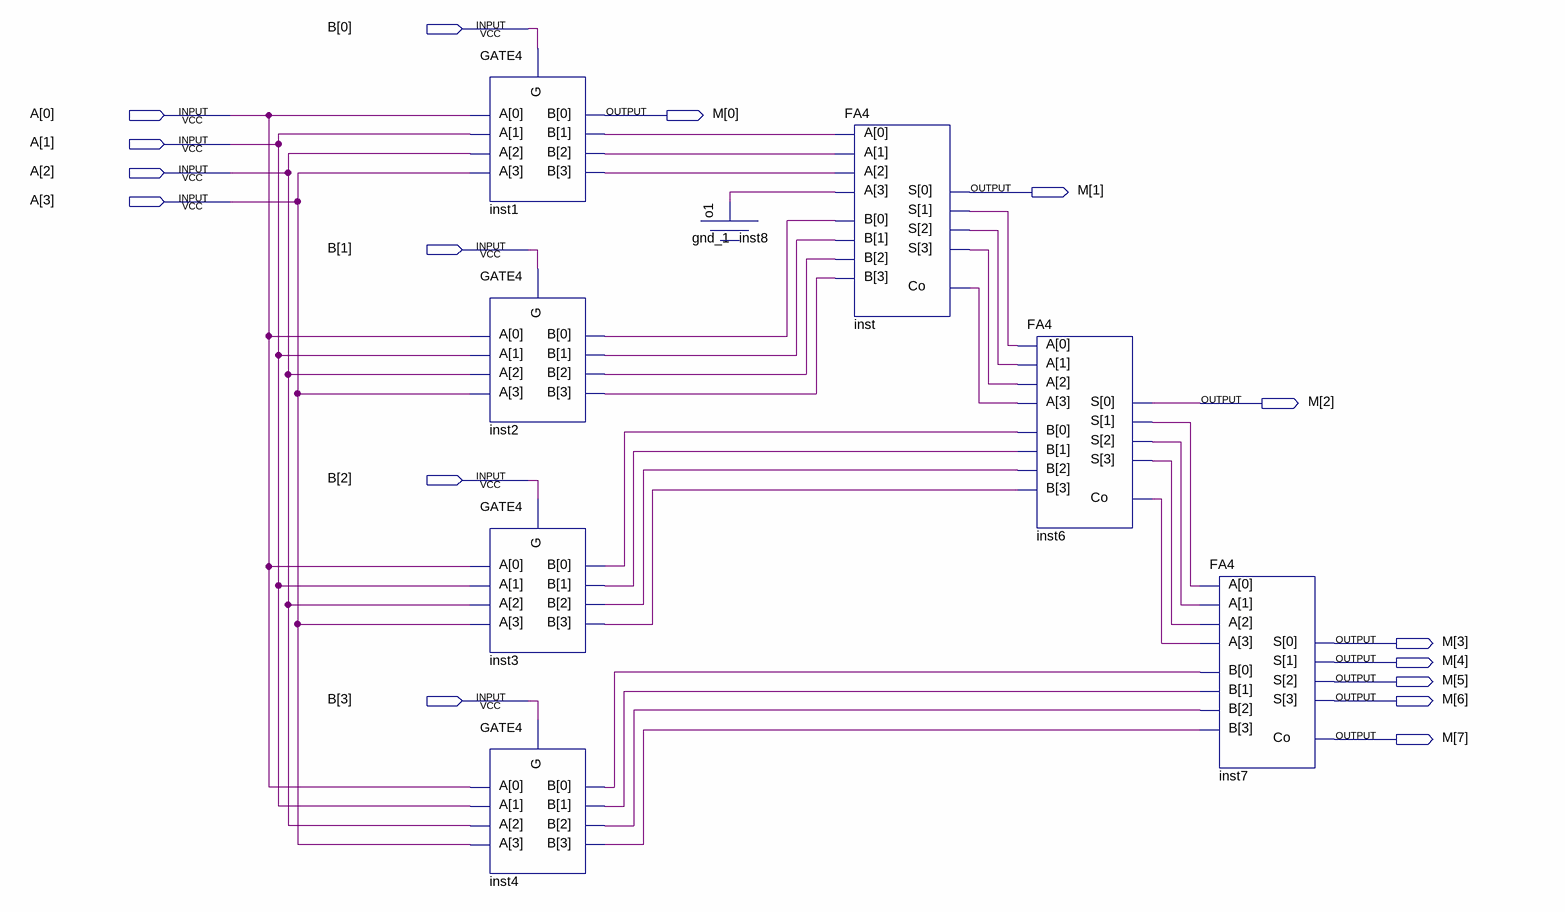
[diagram p0: schematic sheet]
// Quartus schematic MU4.bdf as structural Verilog: 8 symbols, 16 pins
module MU4 (
  input  [3:0] B,
  input  [3:0] A,
  output [7:0] M
);

  wire inst1_b, inst1_b_2, inst1_b_3, inst2_b, inst2_b_2, inst2_b_3, inst2_b_4, inst3_b, inst3_b_2,
       inst3_b_3, inst3_b_4, inst4_b, inst4_b_2, inst4_b_3, inst4_b_4, inst6_co, inst6_s, inst6_s_2,
       inst6_s_3, inst8_o1, inst_co, inst_s, inst_s_2, inst_s_3;

  GATE4 inst1 (.A(A), .G(B[0]), .B({inst1_b_3, inst1_b_2, inst1_b, M[0]}));
  GATE4 inst2 (.A(A), .G(B[1]), .B({inst2_b, inst2_b_2, inst2_b_3, inst2_b_4}));
  GATE4 inst3 (.A(A), .G(B[2]), .B({inst3_b_4, inst3_b_3, inst3_b_2, inst3_b}));
  GATE4 inst4 (.A(A), .G(B[3]), .B({inst4_b_4, inst4_b_3, inst4_b_2, inst4_b}));
  gnd_1 inst8 (.o1(inst8_o1));
  FA4 inst (
    .A({inst8_o1, inst1_b_3, inst1_b_2, inst1_b}), .B({inst2_b, inst2_b_2, inst2_b_3, inst2_b_4}),
    .S({inst_s_3, inst_s_2, inst_s, M[1]}), .Co(inst_co));
  FA4 inst6 (
    .A({inst_co, inst_s_3, inst_s_2, inst_s}), .B({inst3_b_4, inst3_b_3, inst3_b_2, inst3_b}),
    .S({inst6_s_3, inst6_s_2, inst6_s, M[2]}), .Co(inst6_co));
  FA4 inst7 (
    .A({inst6_co, inst6_s_3, inst6_s_2, inst6_s}), .B({inst4_b_4, inst4_b_3, inst4_b_2, inst4_b}),
    .S(M[6:3]), .Co(M[7]));
endmodule
